# EAGLE design omcPendelautomatik (EAGLE 7.7.0)
Assembly variants: VO_3V2_FIX
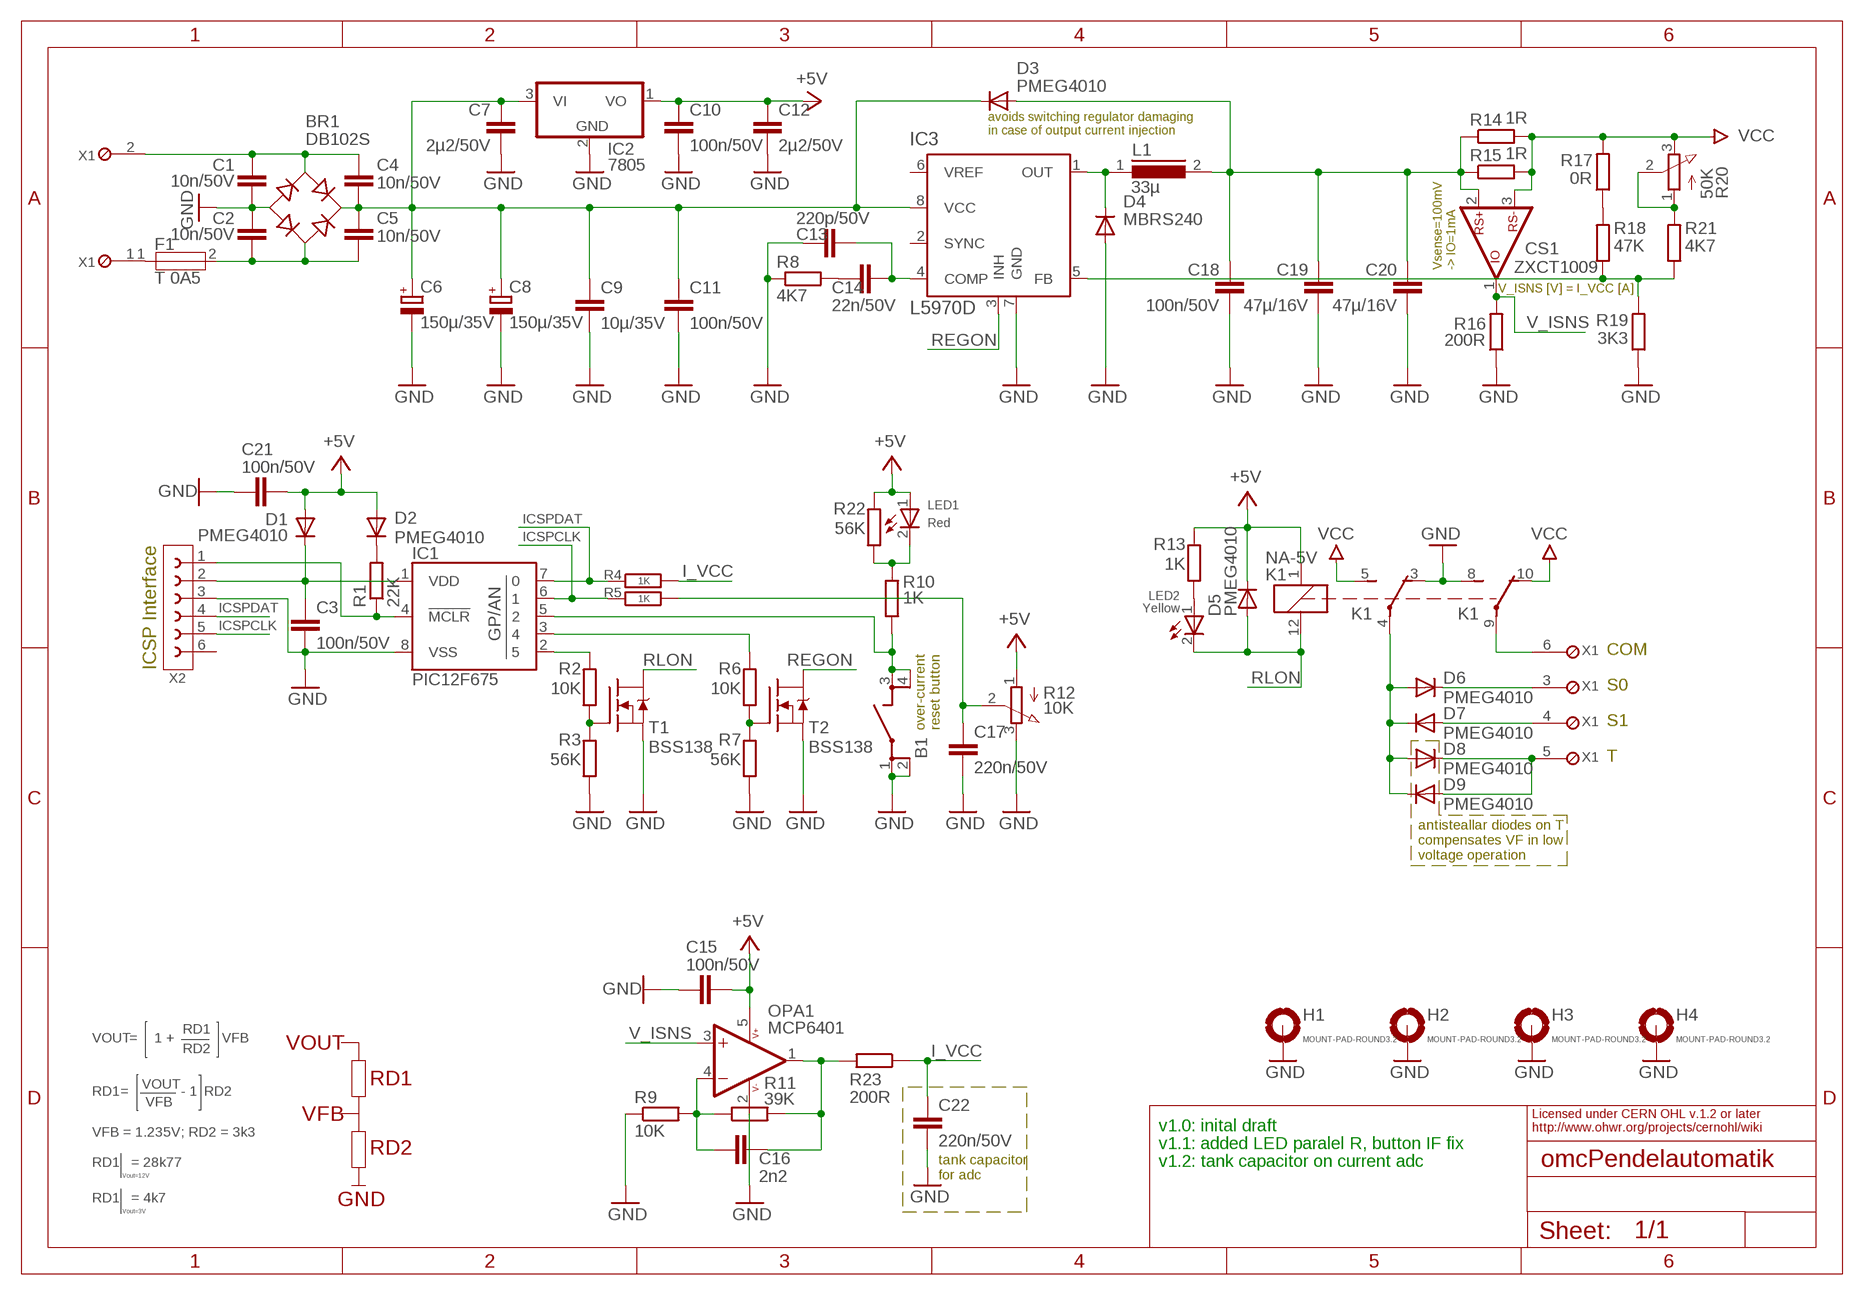
[diagram p0: schematic, sheet 1]

## Parts
B1  JTP1138/4.3  JTP1138-4.3MM  [SMD_X4_11X6]
BR1  DB102S  RECT-DIL-1A-100V-SMD  [DBS]
C1  10n/50V  X7R-10000P-1206  [1206]
C2  10n/50V  X7R-10000P-1206  [1206]
C3  100n/50V  X7R-100000P-1206  [1206]
C4  10n/50V  X7R-10000P-1206  [1206]
C5  10n/50V  X7R-10000P-1206  [1206]
C6  150µ/35V  AEC-150U-35V-F  [PANF]
C7  2µ2/50V  X7R-2200000P-1206  [1206]
C8  150µ/35V  AEC-150U-35V-F  [PANF]
C9  10µ/35V  X7R-10000000P-1210  [1210]
C10  100n/50V  X7R-100000P-1206  [1206]
C11  100n/50V  X7R-100000P-1206  [1206]
C12  2µ2/50V  X7R-2200000P-1206  [1206]
C13  220p/50V  NP0-220P-1206  [1206]
C14  22n/50V  X7R-22000P-1206  [1206]
C15  100n/50V  X7R-100000P-1206  [1206]
C16  2n2  NP0-2200P-1206  [1206]
C17  220n/50V  X7R-220000P-1206  [1206]
C18  100n/50V  X7R-100000P-1206  [1206]
C19  47µ/16V  X5R-47000000P-1210  [1210]
C20  47µ/16V  X5R-47000000P-1210  [1210]
C21  100n/50V  X7R-100000P-1206  [1206]
C22  220n/50V  X7R-220000P-1206  [1206]
CS1  ZXCT1009  ZXCT1009F  [SOT23]
D1  PMEG4010  PMEGXX10-40VBEA  [SOD323]
D2  PMEG4010  PMEGXX10-40VBEA  [SOD323]
D3  PMEG4010  PMEGXX10-40VBEA  [SOD323]
D4  MBRS240  [DO214AA]
D5  PMEG4010  PMEGXX10-40VBEA  [SOD323]
D6  PMEG4010  PMEGXX10-40VBEA  [SOD323]
D7  PMEG4010  PMEGXX10-40VBEA  [SOD323]
D8  PMEG4010  PMEGXX10-40VBEA  [SOD323]
D9  PMEG4010  PMEGXX10-40VBEA  [SOD323]
F1  T 0A5  OMT-T0A5-125V  [OMT125]
H1  MOUNT-PAD-ROUND3.2  [3,2-PAD]
H2  MOUNT-PAD-ROUND3.2  [3,2-PAD]
H3  MOUNT-PAD-ROUND3.2  [3,2-PAD]
H4  MOUNT-PAD-ROUND3.2  [3,2-PAD]
IC1  PIC12F675  PIC12F675SN  [SOIC08]
IC2  7805  78L05ACY  [SOT89W]
IC3  L5970D  [SOIC08]
K1  NA-5V  NA-5VDC  [THT_5M08M_5M08M_2M54M]
L1  33µ  PISM-330X  [PISM]
LED1  Red  LEDMONO-RED-KP3216  [LED3216]
LED2  Yellow  LEDMONO-YELLOW-KP3216  [LED3216]
OPA1  MCP6401  [SOT23-5]
R1  22K  RC1206-22000  [1206]
R2  10K  RC1206-10000  [1206]
R3  56K  RC1206-56000  [1206]
R4  1K  RC1206-1000  [1206]
R5  1K  RC1206-1000  [1206]
R6  10K  RC1206-10000  [1206]
R7  56K  RC1206-56000  [1206]
R8  4K7  RC1206-4700  [1206]
R9  10K  RC1206-10000  [1206]
R10  1K  RC1206-1000  [1206]
R11  39K  RC1206-39000  [1206]
R12  10K  M44-10000W  [TTM44W]
R13  1K  RC1206-1000  [1206]
R14  1R  RC1206-1.0  [1206]
R15  1R  RC1206-1.0  [1206]
R16  200R  RC1206-200  [1206]
R17  0R  RC1206-0.0  [1206]
R18  47K  RC1206-47000  [1206]
R19  3K3  RC1206-3300  [1206]
R20  50K  M44-50000W  [TTM44W]  (not fitted in variant VO_3V2_FIX)
R21  4K7  RC1206-4700  [1206]  (not fitted in variant VO_3V2_FIX)
R22  56K  RC1206-56000  [1206]
R23  200R  RC1206-200  [1206]
T1  BSS138  [SOT23]
T2  BSS138  [SOT23]
X1  RT034 Typ 086  SCWTRMX06-3M81  [RT03406T086]
X2  2X3  BOXHD-06-S-2.54  [BOXHD-06-2.54-S]

## Nets
+5V: C10.1 C12.1 C15.2 C21.2 D1.A D2.A D5.C IC2.1(VO) K1.1 LED1.1(A) OPA1.5(V+) R12.1(A) R13.2 R22.2
GND: B1.1 B1.2 BR1.- C1.2 C2.1 C3.2 C6.CN(-) C7.2 C8.CN(-) C9.2 C10.2 C11.2 C12.2 C13.1 C15.1 C17.2 C18.2 C19.2 C20.2 C21.1 C22.2 D4.A H1.B3,2(MOUNT) H2.B3,2(MOUNT) H3.B3,2(MOUNT) H4.B3,2(MOUNT) IC1.8(VSS) IC2.2(GND) IC3.7(GND) K1.3(O) K1.8(S) OPA1.2(V-) R3.1 R7.1 R8.1 R9.1 R12.3(E) R16.1 R19.1 T1.2(S) T2.2(S) X2.3
I_VCC: C22.1 R4.2 R23.1
ICSPCLK: IC1.6 R5.1 X2.5
ICSPDAT: IC1.7 R4.1 X2.4
N$1: D4.C IC3.1(OUT) L1.1
N$2: R20.1(A) R20.2(S) R21.2
N$3: C13.2 C14.1 IC3.4(COMP)
N$4: C14.2 R8.2
N$5: R2.1 R3.2 T1.1(G)
N$6: BR1.+ C4.2 C5.1 C6.CP(+) C7.1 C8.CP(+) C9.1 C11.1 D3.C IC2.3(VI) IC3.8(VCC)
N$7: C3.1 D1.C IC1.1(VDD) X2.2
N$8: F1.1 X1.1
N$9: IC3.5(FB) R18.1 R19.2 R21.1
N$10: IC1.4(!MCLR!) R1.1 X2.1
N$11: D2.C R1.2
N$12: IC1.2 R2.2
N$13: R6.1 R7.2 T2.1(G)
N$14: IC1.3 R6.2
N$15: LED2.1(A) R13.1
N$16: R17.1 R18.2
N$17: BR1.AC1 C1.1 C4.1 X1.2
N$18: D6.C X1.3
N$19: C17.1 R5.2 R12.2(S)
N$20: C16.1 OPA1.4(-IN) R9.2 R11.1
N$21: D7.A X1.4
N$22: D6.A D7.C D8.A D9.C K1.4(P)
N$23: BR1.AC2 C2.2 C5.2 F1.2
N$24: K1.9(P) X1.6
N$27: B1.3 B1.4 IC1.5 R10.1
N$29: D8.C D9.A X1.5
N$32: LED1.2(C) R10.2 R22.1
N$33: C16.2 OPA1.1(OUT) R11.2 R23.2
REGON: IC3.3(INH) T2.3(D)
RLON: D5.A K1.12 LED2.2(C) T1.3(D)
V_ISNS: CS1.1(IOUT) OPA1.3(+IN) R16.2
VCC: CS1.3(-RS) K1.5(S) K1.10(O) R14.2 R15.2 R17.2 R20.3(E)
VOUT: C18.1 C19.1 C20.1 CS1.2(+RS) D3.A L1.2 R14.1 R15.1
Unconnected: IC3.2(SYNC) IC3.6(VREF) X2.6

## Notes on the sheet
- avoids switching regulator damaging
  in case of output current injection
- Vsense=100mV
  -> IO=1mA
- V_ISNS [V] = I_VCC [A]
- COM
- ICSP Interface
- S0
- S1
- over-current
  reset button
- T
- antisteallar diodes on T
  compensates VF in low
  voltage operation
- RD1
- VOUT | = | 1 + | VFB
- RD2 | VOUT
- VOUT | RD1
- RD1 | = | - 1 | RD2
- VFB
- VFB
- v1.0: inital draft
- Licensed under CERN OHL v.1.2 or later
  http://www.ohwr.org/projects/cernohl/wiki
- VFB = 1.235V; RD2 = 3k3
- v1.1: added LED paralel R, button IF fix
- RD2
- RD1 | = 28k77 | v1.2: tank capacitor on current adc
- Vout=12V
- tank capacitor
  for adc
- RD1 | = 4k7 | GND
- Vout=3V

## Power pins joined to a net without a drawn wire
GND: IC2.4(GND)

## Library data of the parts
B1 = omcSwitch:JTP1138: TACT SWITCH - JTP 1138 6mm x 6mm 12 V DC / 0,05 A Bounce Time 10ms Datasheet: Reichelt <https://cdn-reichelt.de/documents/datenblatt/C200/JTP_1138_DB01.PDF>; DIST#REICHELT#: TASTER 9314
BR1 = omcDiode:RECT-DIL-1A: DIL Rechtifier - 1.0A Single-Phase Glass Passivated Bridge Rectifier Diodes Incorporate: Diodes Incorporate Datasheet <http://www.diodes.com/_files/datasheets/ds21201.pdf> (DB10XS) Reichelt Datasheet <http://cdn-reichelt.de/documents/datenblatt/A400/SMD_DF_02_SEP_DB.PDF> (DB10XS) SEP Electronic Corp: Reichelt Datasheet <http://cdn-reichelt.de/documents/datenblatt/A400/DB101S-DB107S_SEP.PDF> (DB10XS) Reichelt Datasheet <http://cdn-reichelt.de/documents/datenblatt/A400/DB101-DB107_SEP.PDF> (DB10X) Diodes Incorporate - Maximum Ratings and Electrical Characteristics Characteristics DB101/S DB102/S DB103/S DB104/S DB105/S DB106/S DB107/S Unit Maximum Recurrent Peak Reverse Voltage 50 100 200 400 600 800 1000 V Maximum RMS Input Voltage 35 70 140 280 420 560 700 V Maximum DC Blocking Voltage 50 100 200 400 600 800 1000 V Maximum Average Rectified Output Current @TA=40°C 1.0 A Peak Forward Surge Current Single Half Sine-wave Superimposed on Rated Load 50 A Maximum Instantaneous Forward Voltage drop per Element at IF=1.0A 1.1 V Maximum Reverse DC Current at Rated @TA=25°C DC Blocking Voltage per Element @TA=100°C 10 500 µA µA Typical Thermal Resistance 40 K/W Storage and Operating Temperature Range -65 to +150 °C; DIST#REICHELT#: SMD DB1A70; VENDOR#: SEP ELECTRONIC CORP.,DB102S
C1 C2 C4 C5 = omcCapacitor:X7R: X7R Ceramic Capacitors YAGEO Multilayer Capacitors For General Purpose Temperature characteristics: X7R Rated Voltage: 50V Operating Temperature Range: –55°C to +125°C Reichelt Datasheet <http://cdn-reichelt.de/documents/datenblatt/B300/X7R.pdf> MURATA GCM Series High Dielectric Constant Type Murata Datasheet <http://www.murata.com/~/media/webrenewal/support/library/catalog/products/capacitor/mlcc/c03e.ashx> Reichelt Datasheet <http://cdn-reichelt.de/documents/datenblatt/A900/DATASHEET_SMD_0805_1206_1210.pdf>; DIST#REICHELT#: X7R-G1206 10N; VENDOR#: YAGEO,12062R103K9BP0D
C3 C10 C11 C15 C18 C21 = omcCapacitor:X7R: X7R Ceramic Capacitors YAGEO Multilayer Capacitors For General Purpose Temperature characteristics: X7R Rated Voltage: 50V Operating Temperature Range: –55°C to +125°C Reichelt Datasheet <http://cdn-reichelt.de/documents/datenblatt/B300/X7R.pdf> MURATA GCM Series High Dielectric Constant Type Murata Datasheet <http://www.murata.com/~/media/webrenewal/support/library/catalog/products/capacitor/mlcc/c03e.ashx> Reichelt Datasheet <http://cdn-reichelt.de/documents/datenblatt/A900/DATASHEET_SMD_0805_1206_1210.pdf>; DIST#REICHELT#: X7R-G1206 100N; VENDOR#: YAGEO,12062R104K9BP0D
C6 C8 = omcCapacitor:AEC: Aluminum Electrolytic Capacitors Panasonic - FC/FK Series: Life time: 105°C 1000 h Operating temperature range: -40 to + 105°C Voltage rating: 6.3 to 50 VDC Capacitance range: 1µF to 1500µF Panasonic Productside <http://industrial.panasonic.com/ww/products/capacitors/aluminum-capacitors/aluminum-cap-smd> Panasonic Datasheet <http://industrial.panasonic.com/cdbs/www-data/pdf/RDE0000/DME0000COL51.pdf> Reichelt Datasheet <http://cdn-reichelt.de/documents/datenblatt/B300/Al-SMD_FCneu.pdf> Distributor Reichelt: avialable Conrad: avialable Digi-Key: -; DIST#REICHELT#: VF 150/35 P-F; ESR: 0R08; I_RIPPLE: 850m; VENDOR#: PANASONIC#EEEFP1V151AP
C7 C12 = omcCapacitor:X7R: X7R Ceramic Capacitors YAGEO Multilayer Capacitors For General Purpose Temperature characteristics: X7R Rated Voltage: 50V Operating Temperature Range: –55°C to +125°C Reichelt Datasheet <http://cdn-reichelt.de/documents/datenblatt/B300/X7R.pdf> MURATA GCM Series High Dielectric Constant Type Murata Datasheet <http://www.murata.com/~/media/webrenewal/support/library/catalog/products/capacitor/mlcc/c03e.ashx> Reichelt Datasheet <http://cdn-reichelt.de/documents/datenblatt/A900/DATASHEET_SMD_0805_1206_1210.pdf>; DIST#REICHELT#: X7R-G1206 2,2/50; VENDOR#: MURATA,GCM31CR71H225KA55
C9 = omcCapacitor:X7R: X7R Ceramic Capacitors YAGEO Multilayer Capacitors For General Purpose Temperature characteristics: X7R Rated Voltage: 50V Operating Temperature Range: –55°C to +125°C Reichelt Datasheet <http://cdn-reichelt.de/documents/datenblatt/B300/X7R.pdf> MURATA GCM Series High Dielectric Constant Type Murata Datasheet <http://www.murata.com/~/media/webrenewal/support/library/catalog/products/capacitor/mlcc/c03e.ashx> Reichelt Datasheet <http://cdn-reichelt.de/documents/datenblatt/A900/DATASHEET_SMD_0805_1206_1210.pdf>; DIST#REICHELT#: X7R-G1210 10; VENDOR#: MURATA,GCM32EC7YA106KA03
C13 = omcCapacitor:NP0: NP0 Surface-Mount Ceramic Multilayer Capacitors YAGEO Multilayer Capacitors For General Purpose RoHS compliant Rated Voltage: 50V Operating Temperature Range: –55°C to +125°C Yageo Datasheet <http://www.yageo.com/documents/recent/UPY-GP_NP0_16V-to-50V_8.pdf> Distributor Reichelt: avialable Conrad: avialable Digi-Key: -; DIST#REICHELT#: NPO-G1206 220P; VENDOR#: YAGEO#1206CG221J9BP
C14 = omcCapacitor:X7R: X7R Ceramic Capacitors YAGEO Multilayer Capacitors For General Purpose Temperature characteristics: X7R Rated Voltage: 50V Operating Temperature Range: –55°C to +125°C Reichelt Datasheet <http://cdn-reichelt.de/documents/datenblatt/B300/X7R.pdf> MURATA GCM Series High Dielectric Constant Type Murata Datasheet <http://www.murata.com/~/media/webrenewal/support/library/catalog/products/capacitor/mlcc/c03e.ashx> Reichelt Datasheet <http://cdn-reichelt.de/documents/datenblatt/A900/DATASHEET_SMD_0805_1206_1210.pdf>; DIST#REICHELT#: X7R-G1206 22N; VENDOR#: YAGEO,12062R223K9BP0D
C16 = omcCapacitor:NP0: NP0 Surface-Mount Ceramic Multilayer Capacitors YAGEO Multilayer Capacitors For General Purpose RoHS compliant Rated Voltage: 50V Operating Temperature Range: –55°C to +125°C Yageo Datasheet <http://www.yageo.com/documents/recent/UPY-GP_NP0_16V-to-50V_8.pdf> Distributor Reichelt: avialable Conrad: avialable Digi-Key: -; DIST#REICHELT#: NPO-G1206 2,2N; VALUE: 2n2/50V; VENDOR#: YAGEO#1206CG222J9BP
C17 C22 = omcCapacitor:X7R: X7R Ceramic Capacitors YAGEO Multilayer Capacitors For General Purpose Temperature characteristics: X7R Rated Voltage: 50V Operating Temperature Range: –55°C to +125°C Reichelt Datasheet <http://cdn-reichelt.de/documents/datenblatt/B300/X7R.pdf> MURATA GCM Series High Dielectric Constant Type Murata Datasheet <http://www.murata.com/~/media/webrenewal/support/library/catalog/products/capacitor/mlcc/c03e.ashx> Reichelt Datasheet <http://cdn-reichelt.de/documents/datenblatt/A900/DATASHEET_SMD_0805_1206_1210.pdf>; DIST#REICHELT#: KEM X7R1206 220N; VENDOR#: KEMET,1206C225K5R
C19 C20 = omcCapacitor:X5R: X5R Ceramic Capacitors Murate GRM Series For General Purpose Temperature characteristics: X5R Size: 0.4×0.2mm to 5.7×5.0mm Rated Voltage: DC2.5V to 3.15kV Operating Temperature Range: –55°C to +85°C Product Side <http://psearch.en.murata.com/capacitor/lineup/grm> Murata Datasheet <http://www.murata.com/~/media/webrenewal/support/library/catalog/products/capacitor/mlcc/c02e.ashx> Distributor Reichelt: avialable Conrad: avialable Digi-Key: -; DIST#REICHELT#: X5R-G1210 47; VENDOR#: MURATA,GRM32ER61C476ME15#
CS1 = omcPwrSupply:ZXCT1009: ZXCT1009 - HIGH-SIDE CURRENT MONITOR Low cost, accurate high-side current sensing Output voltage scaling Up to 2.5V sense voltage 2.5V to 20V supply range 4μA quiescent current 1% typical accuracy SOT23 and SM8 packages Datasheet Diodes Incorporated <https://www.diodes.com/assets/Datasheets/ZXCT1009.pdf> Reichelt <https://cdn-reichelt.de/documents/datenblatt/A200/DID_ZXCT1009_ENG_TDS.pdf>; DIST#REICHELT#: ZXCT 1009FTA; VENDOR#: Diodes Incorporated, ZXCT1009
D1-D3 D5-D9 = omcDiode:PMEGXX10: PMEGXX10 - 1A very low VF MEGA Schottky barrier rectifier - NXP Schottky Forward current: 1 A Reverse voltages: 20V, 30V, 40V Very low forward voltage Datasheet: Nexperia <https://assets.nexperia.com/documents/data-sheet/PMEGXX10BEA_PMEGXX10BEV.pdf> Reichelt <https://cdn-reichelt.de/documents/datenblatt/A400/PMEG4010BEA_ENG_TDS.pdf>; DIST#REICHELT#: PMEG 4010BEA NXP; VENDOR#: NXP,PMEG3010BEA
D4 = omcDiode:MBRS2: MBRS2X0 - 2A Schottky Power Rectifier Schottky barrier rectifiers 2A 40V SMB 403A-03 (DO213AB) Package Fairchild MBRS320 Datasheet <https://www.fairchildsemi.com/datasheets/MB/MBRS320.pdf> Reichelt Datasheet <http://cdn-reichelt.de/documents/datenblatt/A400/MBRS240SMD_ONS.pdf> Characteristics MBRS240 Unit Peak Repetitive Reverse Voltage 40 V Average Rectified Forward Current 2.0 @100°C A Nonrepetitive Peak Surge Current 25 A Operating Junction Temperature – 55 to +150 °C Thermal Resistance — Junction to Lead 18 °C/W Maximum Instantaneous Forward Voltage (IF = 3.0 A, TJ = 25°C)) 0.43 V Maximum Instantaneous Reverse Current Rated dc Voltage, TJ = 25°C Rated dc Voltage, TJ = 100°C 2.0 60 mA; DIST#REICHELT#: MBRS 240 SMD; VENDOR#: On Semiconductor,MBRS240LT3G
F1 = omcFuse:OMT: OMT - Non resettable SMD Fuse Describtion Directly solderable on printed circuit boards Standards UL 248-14 CSA C22.2 no. 248.14 Approvals UL File Number: E41599 Technical Data Type OMT125 OMT250 Rated Voltage 125 VAC/DC 125 - 250VAC, 125 VDC Rated Current 0.25 - 5 A 0.75 - 5A Breaking Capacity 100 A 50A - 100A Characteristic Time-Lag T Time-Lag T Mounting PCB,SMT Admissible Ambient Air Temp. -40 °C to 85 °C Climatic Category 40/085/21 acc. to IEC 60068-1 Material: Housing Thermoplastic, UL 94V-0 Material: Terminals Tin-Plated Copper Alloy Datasheet Schurter <http://www.schurter.ch/bundles/snceschurter/epim/_ProdPool_/newDS/de/typ_OMT_125.pdf> Reichelt <http://cdn-reichelt.de/documents/datenblatt/C400/typ_OMT_125.pdf> Schurter <http://www.schurter.ch/bundles/snceschurter/epim/_ProdPool_/newDS/de/typ_OMT.pdf> Reichelt <http://cdn-reichelt.de/documents/datenblatt/C400/OMT.pdf> Distributor Reichelt: avialable Conrad: Digi-Key:; DIST#REICHELT#: OMT 125 0,5A; VENDOR#: Schurter,3404.0112.11
H1-H4 = holes:MOUNT-PAD-ROUND: MOUNTING PAD, round
IC1 = omcPIC:PIC12F675: PIC12F675 - 8-Pin FLASH-Based 8-Bit CMOS Microcontrollers High Performance RISC CPU: Only 35 instructions All single cycle instructions except branches Operating speed: DC - 20 MHz oscillator/clock input DC - 200 ns instruction cycle Interrupt capability 8-level deep hardware stack Direct, Indirect, and Relative Addressing modes Special Microcontroller Features: Internal and external oscillator options Precision Internal 4 MHz oscillator factory calibrated to ±1% External Oscillator support for crystals and resonators 5 µs wake-up from SLEEP, 3.0V, typical Power saving SLEEP mode Wide operating voltage range - 2.0V to 5.5V Industrial and Extended temperature range Low power Power-on Reset (POR) Power-up Timer (PWRT) and Oscillator Start-up Timer (OST) Brown-out Detect (BOD) Watchdog Timer (WDT) with independent oscillator for reliable operation Multiplexed MCLR/Input-pin Interrupt-on-pin change Individual programmable weak pull-ups Programmable code protection High Endurance FLASH/EEPROM Cell 100,000 write FLASH endurance 1,000,000 write EEPROM endurance FLASH/Data EEPROM Retention: > 40 years Low Power Features: Standby Current: 1 nA @ 2.0V, typical Operating Current: 8.5 µA @ 32 kHz, 2.0V, typical 100 µA @ 1 MHz, 2.0V, typical Watchdog Timer Current: 300 nA @ 2.0V, typical Timer1 oscillator current: 4 µA @ 32 kHz, 2.0V, typical Peripheral Features: 6 I/O pins with individual direction control High current sink/source for direct LED drive Analog comparator module with: One analog comparator Programmable on-chip comparator voltage reference (CVREF) module Programmable input multiplexing from device inputs Comparator output is externally accessible Analog-to-Digital Converter module: 10-bit resolution Programmable 4-channel input Voltage reference input Timer0: 8-bit timer/counter with 8-bit programmable prescaler Enhanced Timer1: 16-bit timer/counter with prescaler External Gate Input mode Option to use OSC1 and OSC2 in LP mode as Timer1 oscillator, if INTOSC mode selected In-Circuit Serial Programming (ICSP) via two pins Reference: Microchip Datasheet <http://ww1.microchip.com/downloads/en/DeviceDoc/41190G.pdf> Reichelt Datasheet <http://cdn-reichelt.de/documents/datenblatt/A300/PIC12F629_PIC12F675%23MIC.pdf>; DIST#REICHELT#: PIC 12F675-I/SN; VENDOR#: Microchip#PIC12F675-I/SN
IC2 = omcPwrSupply:78L: STMicroelectronics - L78L - Positive voltage regulators Output current up to 100 mA Output voltages of 3.3; 5; 6; 8; 9; 10; 12; 15; 18; 24 V Thermal overload protection Short-circuit protection No external components are required STM Datasheet <www.st.com/resource/en/datasheet/l78l.pdf> Reichelt Datasheet <http://cdn-reichelt.de/documents/datenblatt/A200/DS_TS78_SERIES.pdf> (Taiwan Semiconductor); DIST#REICHELT#: TS 78L05 ACY; VENDOR#: STM,L78L05ABUTR
IC3 = omcPwrSupply:L5970D: STMicroelectronics - L5970D - Up to 1A step down switching regulator Up to 1A output current Operating input voltage from 4.4V to 36V 3.3V / (±2%) reference voltage Output voltage adjustable from 1.2V to 35V Low dropout operation: 100% duty cycle 250KHz Internally fixed frequency Voltage feedforward Zero load current operation Internal current limiting Inhibit for zero current consumption Synchronization Protection against feedback disconnection Thermal shutdown STM Datasheet <http://www.st.com/web/en/resource/technical/document/datasheet/CD00002173.pdf> Reichelt Datasheet <http://cdn-reichelt.de/documents/datenblatt/A200/DS_5970D.pdf>; DIST#CONRAD#: 1185187 - 62; DIST#REICHELT#: L 5970 D; VENDOR#: STM,L5970D013TR
K1 = omcRelay:NA: Fujitsu NA - Minature Relay - 2 Poles - 1 to 2A 2-pole max. Voltage: 125VAC / 30VDC max. Power: 62VA / 30W min load: 0.01mA, 10mVDC slim type relay for high density mounting UL, CSA recognized Datasheet Fujitsu <https://www.fujitsu.com/downloads/MICRO/fcai/relays/na.pdf> Reichelt <https://cdn-reichelt.de/documents/datenblatt/C300/RELAIS-NA.pdf>; DIST#REICHELT#: NA 05W K; VENDOR#: Fujitsu,NAA-05W-K
L1 = omcInductor:PISM: PISM - SMD Power Inductors Inductance: 1µH - 2200µH Current: 0.25A - 10A Mounting: SMD Material: Ferrite Dimension: L: 13mm W: 9.55mm H: 5.35mm Fastron Datasheet <http://www.fastrongroup.com/image-show/56/PISM.pdf?type=Complete-DataSheet&productType=series> Reichelt Datasheet <http://cdn-reichelt.de/documents/datenblatt/B400/PISM.pdf> Inductance L [µH] fL [MHz] SRFmin [MHz] DCRmax [Ω] Rated DC Current [A] Isat IΔT 1.0 0.1 115 0.008 10 6.9 1.5 0.1 90 0.009 9 6.5 2.2 0.1 80 0.010 8 6.2 3.3 0.1 58 0.014 7 5.5 4.7 0.1 49 0.017 6 4.9 6.8 0.1 39 0.022 5.1 4.4 10 0.1 28 0.036 4.2 3.9 15 0.1 22 0.050 3.2 3.2 22 0.1 17 0.060 2.7 2.7 33 0.1 13 0.100 2.1 2.1 47 0.1 10 0.140 1.7 1.7 68 0.1 8.5 0.190 1.5 1.5 100 0.1 7.0 0.280 1.2 1.2 150 0.1 5.3 0.420 1.0 1.0 220 0.1 4.1 0.600 0.85 0.85 330 0.1 3.2 0.900 0.65 0.65 470 0.1 2.8 1.250 0.55 0.55 680 0.1 2.3 2.00 0.45 0.45 1000 0.1 1.7 2.70 0.35 0.35 2200 0.1 1.4 7.00 0.25 0.22 Distributor Reichelt: L-PISM XXµ Conrad: avialable Digi-Key: -; DIST#REICHELT#: L-PISM 33µ; VENDOR#: Fastron,PISM-330X-04
LED1 = omcOpto:LEDMONO: LED Monochromatic Knighbright (KP3216) 3.2x1.6mm (1206) SMD chip LED lamps operating temperature: -40 to +85 °C Reichelt Datasheet (Red/Green/Yellow) <http://cdn-reichelt.de/documents/datenblatt/A500/KP-3216SERIES.pdf> Reichelt Datasheet (Blue) <http://cdn-reichelt.de/documents/datenblatt/A500/KP-3216QBC-D.pdf> Knighbright (KP2012) 2.0x1.25mm (0805) SMD chip LED lamps Conrad Datasheet <http://www.produktinfo.conrad.com/datenblaetter/1000000-1099999/001050393-da-01-en-SMD_CHIPLED_OR_0805_KP_2012SECK.pdf> Knighbright (KP1608) SMD 0603 1.6mm x 0.8mm SMD LED Datasheet Color: Blue [Conrad] <http://www.produktinfo.conrad.com/datenblaetter/1000000-1099999/001050379-da-01-en-SMD_CHIPLED_BL_0603_KP_1608QBC_D.pdf> Green [Conrad] <http://www.produktinfo.conrad.com/datenblaetter/1000000-1099999/001050377-da-01-en-SMD_CHIPLED_GR_0603_KP_1608CGCK.pdf> Orange [Conrad] <http://www.produktinfo.conrad.com/datenblaetter/1000000-1099999/001050375-da-01-en-SMD_CHIPLED_OR_0603_KP_1608SECK.pdf> Red [Conrad] <http://www.produktinfo.conrad.com/datenblaetter/1000000-1099999/001050374-da-01-en-SMD_CHIPLED_ROT_0603_KP_1608SURCK.pdf> Yellow [Conrad] <http://www.produktinfo.conrad.com/datenblaetter/1000000-1099999/001050376-da-01-en-SMD_CHIPLED_GE_0603_KP_1608SYCK.pdf> Everlight (2521) 3.2x1.6mm (1206) SMD chip LED lamps Reichelt Datasheet (Orange) <http://cdn-reichelt.de/documents/datenblatt/A500/15-21-S2C-AQ2R2B.pdf> Reichelt Datasheet (White) <http://cdn-reichelt.de/documents/datenblatt/A500/15-21-T7D-JQ2S1PY.pdf> Lucky Light (S172) 2.0x1.25mm (0805) SMD chip LED lamps Reichelt Datasheet (White) <http://cdn-reichelt.de/documents/datenblatt/A500/S172W-W2-1C.pdf>; DIST#REICHELT#: SMD-LED 1206 RT; VENDOR#: Kingbright,KP-3216HD
LED2 = omcOpto:LEDMONO: LED Monochromatic Knighbright (KP3216) 3.2x1.6mm (1206) SMD chip LED lamps operating temperature: -40 to +85 °C Reichelt Datasheet (Red/Green/Yellow) <http://cdn-reichelt.de/documents/datenblatt/A500/KP-3216SERIES.pdf> Reichelt Datasheet (Blue) <http://cdn-reichelt.de/documents/datenblatt/A500/KP-3216QBC-D.pdf> Knighbright (KP2012) 2.0x1.25mm (0805) SMD chip LED lamps Conrad Datasheet <http://www.produktinfo.conrad.com/datenblaetter/1000000-1099999/001050393-da-01-en-SMD_CHIPLED_OR_0805_KP_2012SECK.pdf> Knighbright (KP1608) SMD 0603 1.6mm x 0.8mm SMD LED Datasheet Color: Blue [Conrad] <http://www.produktinfo.conrad.com/datenblaetter/1000000-1099999/001050379-da-01-en-SMD_CHIPLED_BL_0603_KP_1608QBC_D.pdf> Green [Conrad] <http://www.produktinfo.conrad.com/datenblaetter/1000000-1099999/001050377-da-01-en-SMD_CHIPLED_GR_0603_KP_1608CGCK.pdf> Orange [Conrad] <http://www.produktinfo.conrad.com/datenblaetter/1000000-1099999/001050375-da-01-en-SMD_CHIPLED_OR_0603_KP_1608SECK.pdf> Red [Conrad] <http://www.produktinfo.conrad.com/datenblaetter/1000000-1099999/001050374-da-01-en-SMD_CHIPLED_ROT_0603_KP_1608SURCK.pdf> Yellow [Conrad] <http://www.produktinfo.conrad.com/datenblaetter/1000000-1099999/001050376-da-01-en-SMD_CHIPLED_GE_0603_KP_1608SYCK.pdf> Everlight (2521) 3.2x1.6mm (1206) SMD chip LED lamps Reichelt Datasheet (Orange) <http://cdn-reichelt.de/documents/datenblatt/A500/15-21-S2C-AQ2R2B.pdf> Reichelt Datasheet (White) <http://cdn-reichelt.de/documents/datenblatt/A500/15-21-T7D-JQ2S1PY.pdf> Lucky Light (S172) 2.0x1.25mm (0805) SMD chip LED lamps Reichelt Datasheet (White) <http://cdn-reichelt.de/documents/datenblatt/A500/S172W-W2-1C.pdf>; DIST#REICHELT#: SMD-LED 1206 GE; VENDOR#: Kingbright,KP-3216SYD
OPA1 = omcOpAmp:MCP6401: MCP6401 - 1 MHz, 45 μA Op Amps - Microchip Low Quiescent Current: 45 μA (typical) Gain Bandwidth Product: 1 MHz (typical) Rail-to-Rail Input and Output Supply Voltage Range: 1.8V to 6.0V Unity Gain Stable Extended Temperature Range: -40°C to +125°C No Phase Reversal Datasheet: Microchip <http://ww1.microchip.com/downloads/en/devicedoc/22229d.pdf> Reichelt <https://cdn-reichelt.de/documents/datenblatt/A200/MCP6401-2-4.pdf>; DIST#REICHELT#: MCP 6401T-E/OT; VENDOR#: Microchip, MCP6401T-E/OT
R1 = omcResistor:RC1206: YAGEO RC1206 - General Purpose Chip Resistors Power dissipation: 0.250W 1% Tolerance E96 Series Operating Temperature Range: –55°C to +155°C Maximum Working Voltage: 200V Maximum Overload Voltage: 400V Temperature Coefficient: 10Ω< R≤10MΩ: ±100 ppm/°C R≤10Ω || R>10 MΩ: ±200 ppm/°C Jumper Criteria Rated Current: 2A Maximum Current: 10A Yageo Datasheet <http://www.yageo.ru/pdf/RC1206.pdf> Reichelt Datasheet <http://cdn-reichelt.de/documents/datenblatt/A900/SMD_1206.pdf> Distributor Reichelt: E24 Conrad: avialable Digi-Key: -; DIST#REICHELT#: SMD 1/4W 22K; VENDOR#: YAGEO#RC1206FR-0722KL
R2 R6 R9 = omcResistor:RC1206: YAGEO RC1206 - General Purpose Chip Resistors Power dissipation: 0.250W 1% Tolerance E96 Series Operating Temperature Range: –55°C to +155°C Maximum Working Voltage: 200V Maximum Overload Voltage: 400V Temperature Coefficient: 10Ω< R≤10MΩ: ±100 ppm/°C R≤10Ω || R>10 MΩ: ±200 ppm/°C Jumper Criteria Rated Current: 2A Maximum Current: 10A Yageo Datasheet <http://www.yageo.ru/pdf/RC1206.pdf> Reichelt Datasheet <http://cdn-reichelt.de/documents/datenblatt/A900/SMD_1206.pdf> Distributor Reichelt: E24 Conrad: avialable Digi-Key: -; DIST#REICHELT#: SMD 1/4W 10K; VENDOR#: YAGEO#RC1206FR-0710KL
R3 R7 R22 = omcResistor:RC1206: YAGEO RC1206 - General Purpose Chip Resistors Power dissipation: 0.250W 1% Tolerance E96 Series Operating Temperature Range: –55°C to +155°C Maximum Working Voltage: 200V Maximum Overload Voltage: 400V Temperature Coefficient: 10Ω< R≤10MΩ: ±100 ppm/°C R≤10Ω || R>10 MΩ: ±200 ppm/°C Jumper Criteria Rated Current: 2A Maximum Current: 10A Yageo Datasheet <http://www.yageo.ru/pdf/RC1206.pdf> Reichelt Datasheet <http://cdn-reichelt.de/documents/datenblatt/A900/SMD_1206.pdf> Distributor Reichelt: E24 Conrad: avialable Digi-Key: -; DIST#REICHELT#: SMD 1/4W 56K; VENDOR#: YAGEO#RC1206FR-0756KL
R4 R5 R10 R13 = omcResistor:RC1206: YAGEO RC1206 - General Purpose Chip Resistors Power dissipation: 0.250W 1% Tolerance E96 Series Operating Temperature Range: –55°C to +155°C Maximum Working Voltage: 200V Maximum Overload Voltage: 400V Temperature Coefficient: 10Ω< R≤10MΩ: ±100 ppm/°C R≤10Ω || R>10 MΩ: ±200 ppm/°C Jumper Criteria Rated Current: 2A Maximum Current: 10A Yageo Datasheet <http://www.yageo.ru/pdf/RC1206.pdf> Reichelt Datasheet <http://cdn-reichelt.de/documents/datenblatt/A900/SMD_1206.pdf> Distributor Reichelt: E24 Conrad: avialable Digi-Key: -; DIST#REICHELT#: SMD 1/4W 1,0K; VENDOR#: YAGEO#RC1206FR-071K0L
R8 R21 = omcResistor:RC1206: YAGEO RC1206 - General Purpose Chip Resistors Power dissipation: 0.250W 1% Tolerance E96 Series Operating Temperature Range: –55°C to +155°C Maximum Working Voltage: 200V Maximum Overload Voltage: 400V Temperature Coefficient: 10Ω< R≤10MΩ: ±100 ppm/°C R≤10Ω || R>10 MΩ: ±200 ppm/°C Jumper Criteria Rated Current: 2A Maximum Current: 10A Yageo Datasheet <http://www.yageo.ru/pdf/RC1206.pdf> Reichelt Datasheet <http://cdn-reichelt.de/documents/datenblatt/A900/SMD_1206.pdf> Distributor Reichelt: E24 Conrad: avialable Digi-Key: -; DIST#REICHELT#: SMD 1/4W 4,7K; VENDOR#: YAGEO#RC1206FR-074K7L
R11 = omcResistor:RC1206: YAGEO RC1206 - General Purpose Chip Resistors Power dissipation: 0.250W 1% Tolerance E96 Series Operating Temperature Range: –55°C to +155°C Maximum Working Voltage: 200V Maximum Overload Voltage: 400V Temperature Coefficient: 10Ω< R≤10MΩ: ±100 ppm/°C R≤10Ω || R>10 MΩ: ±200 ppm/°C Jumper Criteria Rated Current: 2A Maximum Current: 10A Yageo Datasheet <http://www.yageo.ru/pdf/RC1206.pdf> Reichelt Datasheet <http://cdn-reichelt.de/documents/datenblatt/A900/SMD_1206.pdf> Distributor Reichelt: E24 Conrad: avialable Digi-Key: -; DIST#REICHELT#: SMD 1/4W 39K; VENDOR#: YAGEO#RC1206FR-0739KL
R12 = omcResistor:M44: Model 44 - Cermet Trimming Potentiometer - TT Electronics Electrical: Standard Resistance Range: 10 Ohms to 2 Megohms Standard Resistance Tolerance: ±10% (<100 Ohms = ±20%) Input Voltage: 300 Vdc Max. or rms not to exceed power rating Power Rating: 0.25 Watts at 85°C derating to 0 at 150°C Environmental: Operating Temperature: –65°C to +150°C Load Life: 1,000 hours at 85°C & 0.25 Watts Datasheet: TT Electronics <https://www.ttelectronics.com/TTElectronics/media/ProductFiles/Trimmers/Datasheets/44.pdf> Reichelt <https://cdn-reichelt.de/documents/datenblatt/B400/BI-SERIE-44.pdf>; DIST#REICHELT#: 44W-10K; VENDOR#: TT Electronics, 44 G R 10K LF
R14 R15 = omcResistor:RC1206: YAGEO RC1206 - General Purpose Chip Resistors Power dissipation: 0.250W 1% Tolerance E96 Series Operating Temperature Range: –55°C to +155°C Maximum Working Voltage: 200V Maximum Overload Voltage: 400V Temperature Coefficient: 10Ω< R≤10MΩ: ±100 ppm/°C R≤10Ω || R>10 MΩ: ±200 ppm/°C Jumper Criteria Rated Current: 2A Maximum Current: 10A Yageo Datasheet <http://www.yageo.ru/pdf/RC1206.pdf> Reichelt Datasheet <http://cdn-reichelt.de/documents/datenblatt/A900/SMD_1206.pdf> Distributor Reichelt: E24 Conrad: avialable Digi-Key: -; DIST#REICHELT#: SMD 1/4W 1,0; VENDOR#: YAGEO#RC1206FR-071R0L
R16 R23 = omcResistor:RC1206: YAGEO RC1206 - General Purpose Chip Resistors Power dissipation: 0.250W 1% Tolerance E96 Series Operating Temperature Range: –55°C to +155°C Maximum Working Voltage: 200V Maximum Overload Voltage: 400V Temperature Coefficient: 10Ω< R≤10MΩ: ±100 ppm/°C R≤10Ω || R>10 MΩ: ±200 ppm/°C Jumper Criteria Rated Current: 2A Maximum Current: 10A Yageo Datasheet <http://www.yageo.ru/pdf/RC1206.pdf> Reichelt Datasheet <http://cdn-reichelt.de/documents/datenblatt/A900/SMD_1206.pdf> Distributor Reichelt: E24 Conrad: avialable Digi-Key: -; DIST#REICHELT#: SMD 1/4W 200; VENDOR#: YAGEO#RC1206FR-07200RL
R17 = omcResistor:RC1206: YAGEO RC1206 - General Purpose Chip Resistors Power dissipation: 0.250W 1% Tolerance E96 Series Operating Temperature Range: –55°C to +155°C Maximum Working Voltage: 200V Maximum Overload Voltage: 400V Temperature Coefficient: 10Ω< R≤10MΩ: ±100 ppm/°C R≤10Ω || R>10 MΩ: ±200 ppm/°C Jumper Criteria Rated Current: 2A Maximum Current: 10A Yageo Datasheet <http://www.yageo.ru/pdf/RC1206.pdf> Reichelt Datasheet <http://cdn-reichelt.de/documents/datenblatt/A900/SMD_1206.pdf> Distributor Reichelt: E24 Conrad: avialable Digi-Key: -; DIST#REICHELT#: SMD 1/4W 0,0; VENDOR#: YAGEO#RC1206FR-070R0L
R18 = omcResistor:RC1206: YAGEO RC1206 - General Purpose Chip Resistors Power dissipation: 0.250W 1% Tolerance E96 Series Operating Temperature Range: –55°C to +155°C Maximum Working Voltage: 200V Maximum Overload Voltage: 400V Temperature Coefficient: 10Ω< R≤10MΩ: ±100 ppm/°C R≤10Ω || R>10 MΩ: ±200 ppm/°C Jumper Criteria Rated Current: 2A Maximum Current: 10A Yageo Datasheet <http://www.yageo.ru/pdf/RC1206.pdf> Reichelt Datasheet <http://cdn-reichelt.de/documents/datenblatt/A900/SMD_1206.pdf> Distributor Reichelt: E24 Conrad: avialable Digi-Key: -; DIST#REICHELT#: SMD 1/4W 47K; VENDOR#: YAGEO#RC1206FR-0747KL
R19 = omcResistor:RC1206: YAGEO RC1206 - General Purpose Chip Resistors Power dissipation: 0.250W 1% Tolerance E96 Series Operating Temperature Range: –55°C to +155°C Maximum Working Voltage: 200V Maximum Overload Voltage: 400V Temperature Coefficient: 10Ω< R≤10MΩ: ±100 ppm/°C R≤10Ω || R>10 MΩ: ±200 ppm/°C Jumper Criteria Rated Current: 2A Maximum Current: 10A Yageo Datasheet <http://www.yageo.ru/pdf/RC1206.pdf> Reichelt Datasheet <http://cdn-reichelt.de/documents/datenblatt/A900/SMD_1206.pdf> Distributor Reichelt: E24 Conrad: avialable Digi-Key: -; DIST#REICHELT#: SMD 1/4W 3,3K; VENDOR#: YAGEO#RC1206FR-073K3L
R20 = omcResistor:M44: Model 44 - Cermet Trimming Potentiometer - TT Electronics Electrical: Standard Resistance Range: 10 Ohms to 2 Megohms Standard Resistance Tolerance: ±10% (<100 Ohms = ±20%) Input Voltage: 300 Vdc Max. or rms not to exceed power rating Power Rating: 0.25 Watts at 85°C derating to 0 at 150°C Environmental: Operating Temperature: –65°C to +150°C Load Life: 1,000 hours at 85°C & 0.25 Watts Datasheet: TT Electronics <https://www.ttelectronics.com/TTElectronics/media/ProductFiles/Trimmers/Datasheets/44.pdf> Reichelt <https://cdn-reichelt.de/documents/datenblatt/B400/BI-SERIE-44.pdf>; DIST#REICHELT#: 44W-50K; VENDOR#: TT Electronics, 44 G R 50K LF
T1 T2 = omcTransistor:BSS138: BSS 138 - N-Channel Logic Level Enhancement Mode Field Effect Transistor VDSS=50V VGS=±20V RDS,on=3.5Ω Drain currunt: 200mA continous 800mA pulsed PD=225mW On Semiconductor Datasheet <http://www.onsemi.com/pub_link/Collateral/BSS138LT1-D.PDF> Reichelt Datasheet <http://cdn-reichelt.de/documents/datenblatt/A200/BSS138-FSC.pdf>; #VENDOR: ON_SEMICONDUCTOR,BSS138L; DIST#REICHELT#: BSS 138 SMD
X1 = omcConnector:SCWTRMX06: Screw solder terminal - X06 pole: 2 srew terminal, plugable rectangular cable connection, 90° stackable without lost of contact RT034 - Typ 086 - 3.81mm grid: Metz Connect Productside <http://www.metz-connect.com/de/products/310861> Metz Connect Datasheet <http://www.metz-connect.com/de/system/files/productfiles/Datenblatt_310861_RT034xxHBLC_OFF-026114I.pdf> Reichelt Datasheet <http://cdn-reichelt.de/documents/datenblatt/C151/AKL086.pdf> RT035 - Typ 094 - 5mm grid: Metz Connect Productside <http://www.metz-connect.com/de/products/310941> Metz Connect Datasheet <http://www.metz-connect.com/de/system/files/productfiles/Datenblatt_310941_RT035xxHBLU_OFF-022741Q.pdf> Metz connect terminal - electrical and mechanical parameter Parameter RT034 - Typ 086 (3.81mm grid) RT035 - Typ 094 (5mm grid) conductor diameter (single wire) 0,2 - 1,5 mm² (AWG 28 - 16) 0,2 - 1,5 mm² (AWG 26 - 16) conductor diameter (multi wire) 0,2 - 1,5 mm² (AWG 28 - 16) 0,2 - 1,5 mm² (AWG 26 - 16) smallest leackage path 2 mm 3,2 mm IEC 60529 IP 00 IP 20 strip length (min) 5mm 6 mm Distributor Reichelt: avialable Conrad: avialable Digi-Key: -; DIST#REICHELT#: AKL 086-06; VENDOR#: Metz Connect#31086106
X2 = omcConnector:BOXHD-06: Box Header 2X3 Mechanical Terminals: 6 Rows: 2 Operating Temperature: -55°C...+105°C Electrical Imax: 3A RInsulation,min: 1000MΩ Rcontact,max: 20mΩ VAC: 550V; DIST#REICHELT#: WSL 6G

## Board
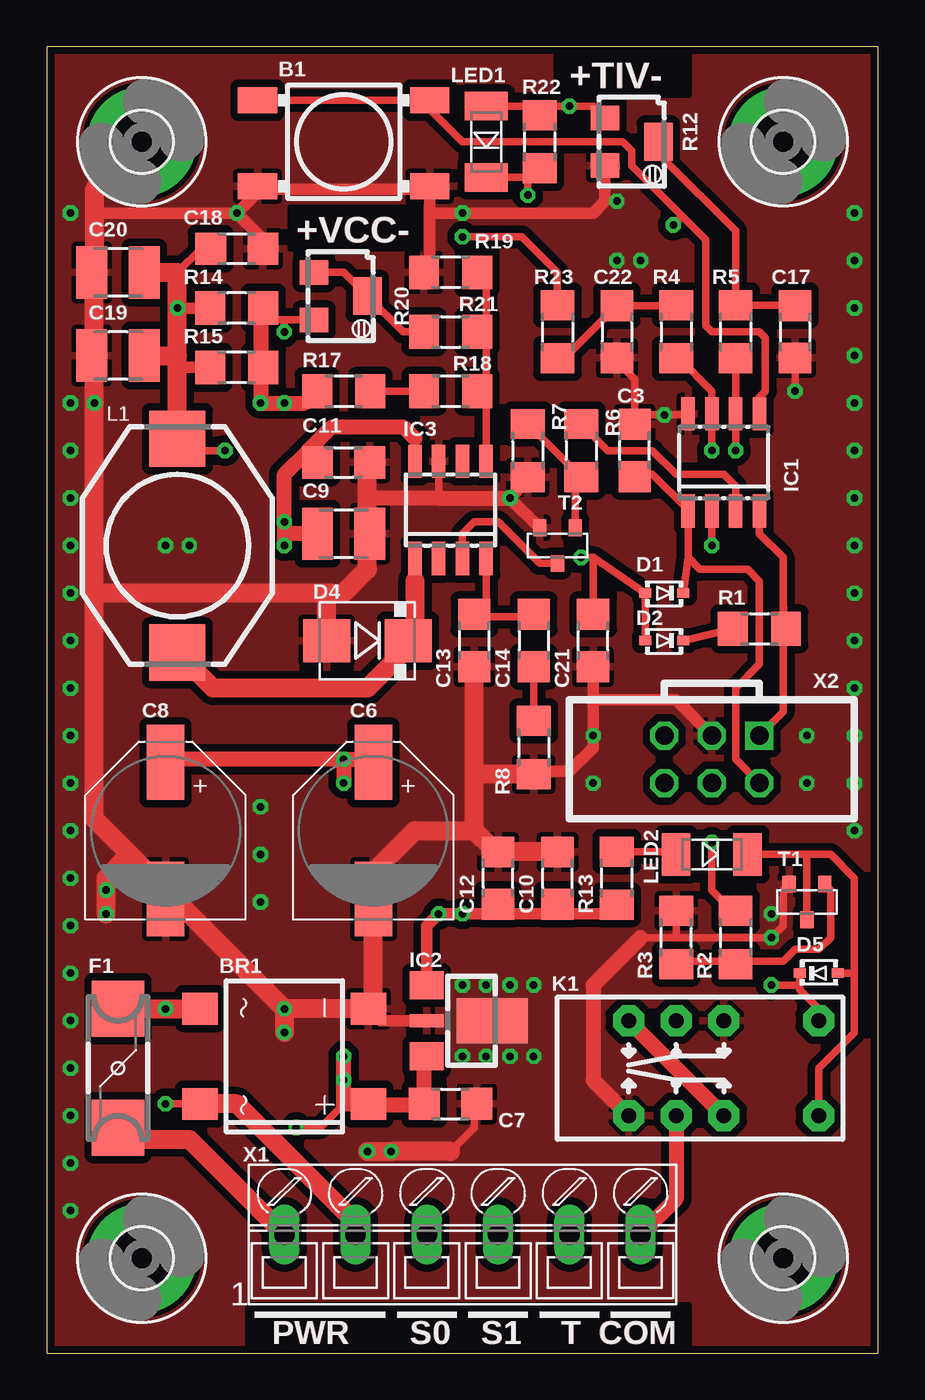
[diagram p1: board, top side]
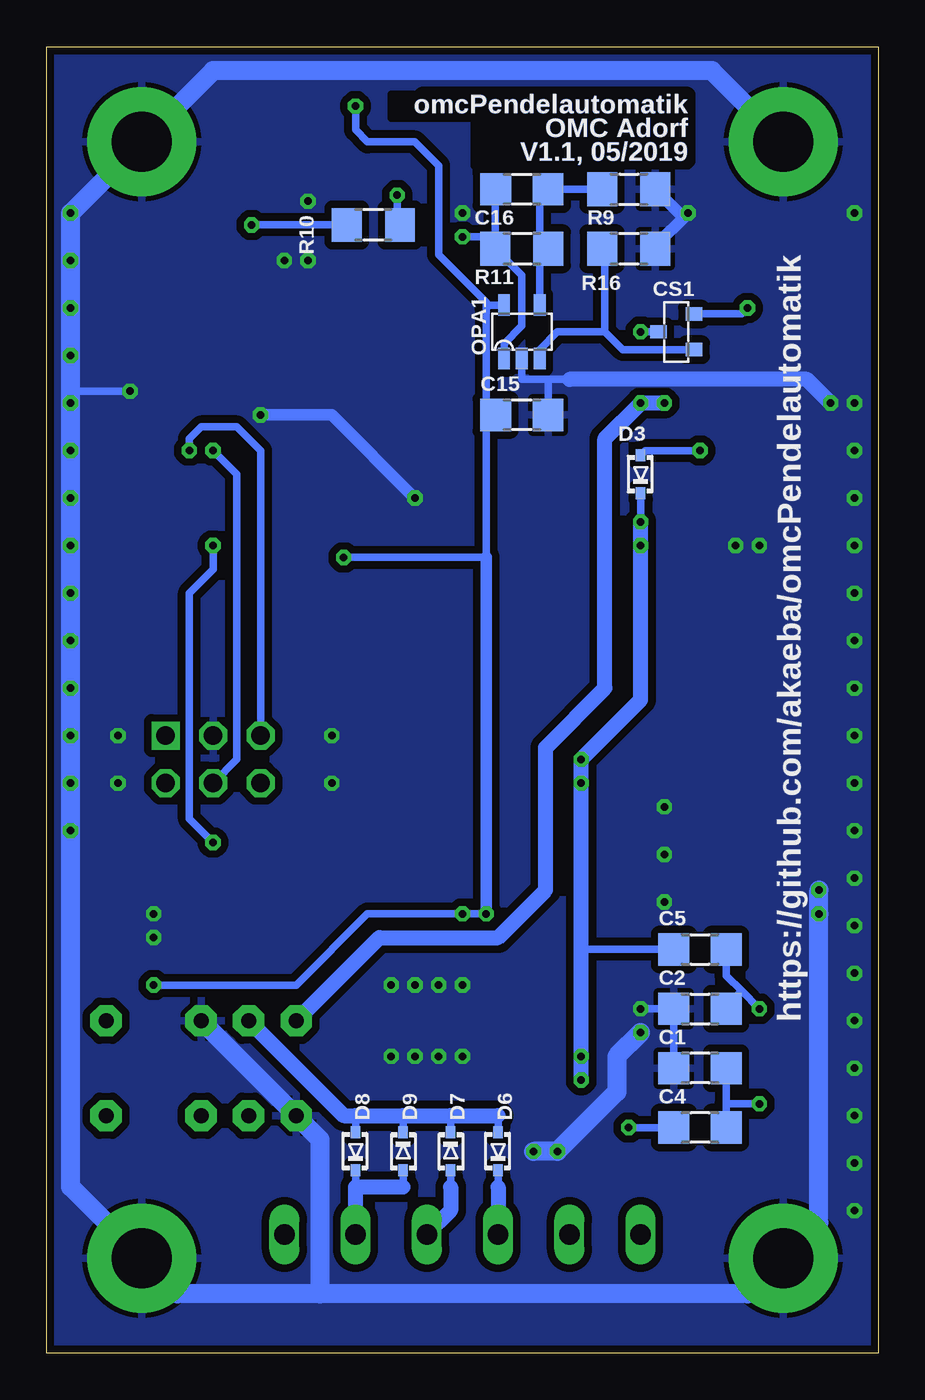
[diagram p2: board, bottom side, seen from below]

Size 44.45 x 69.85 mm. Coordinates in mm from the lower left corner, seen from the top.
Outline: 0,69.84 0,0 44.45,0 44.45,69.85 0,69.85
Copper layers (1*16): Top 0.035mm / dielectric 1.5mm / Bottom 0.035mm
Design rules "aisler_go": minimum track width 0.07mm, minimum drill 0.2mm, track to track 0.07mm, track to pad 0.07mm, pad to pad 0.07mm, via to via 0.07mm, smd to smd 0.07mm, copper to edge 0.2mm, drill to drill 0.21mm, minimum pad ring 0.25mm, minimum via ring 0.05mm, stop-mask expansion 0.05mm, vias tented up to drill 0mil, thermal gap 10mil

### Footprints (pad centres in the part's own frame; a part is rotated, then mirrored left to right if it is on the bottom)
SMD_X4_11X6 = smd 2.1 x 1.4: 1 4.604,-2.381; 2 -4.604,-2.381; 3 4.604,2.223; 4 -4.604,2.223
DBS = smd 1.7 x 1.9: + -2.55,-4.5; - 2.55,-4.5; AC1 -2.55,4.5; AC2 2.55,4.5
1206 = smd 1.651 x 1.727: 1 -1.4,0; 2 1.4,0
PANF = smd 2 x 4: CN 0,-3.651; CP 0,3.651
1210 = smd 1.651 x 2.794: 1 -1.4,0; 2 1.4,0
SOT23 = smd 0.711 x 0.889: 1 -0.953,-0.953; 2 0.953,-0.953; 3 0,0.953
SOD323 = smd 0.635 x 0.508: A 1.016,0; C -1.016,0
DO214AA = smd 2.5 x 2.3: A 2.175,0; C -2.175,0
OMT125 = smd 3 x 2.8: 1 -3.175,0; 2 3.175,0
3,2-PAD = drill 3.2 pad 5.842: B3,2 0,0
SOIC08 = smd 0.72 x 1.78: 1 -1.905,-2.6; 2 -0.635,-2.6; 3 0.635,-2.6; 4 1.905,-2.6; 5 1.905,2.6; 6 0.635,2.6; 7 -0.635,2.6; 8 -1.905,2.6
SOT89W = smd 1.5 x 1.8: 1 -1.905,-1.905; 3 1.905,-1.905 | smd 0.7 x 1.8: 2 0,-1.905 | smd 2.4 x 3.8: 4 0,1.587
SOIC08' = smd 1.78 x 0.72: 1 -2.6,1.905; 2 -2.6,0.635; 3 -2.6,-0.635; 4 -2.6,-1.905; 5 2.6,-1.905; 6 2.6,-0.635; 7 2.6,0.635; 8 2.6,1.905
THT_5M08M_5M08M_2M54M = drill 0.8 pad 1.676 octagon: 1 0,0; 3 5.08,0; 4 7.62,0; 5 10.16,0; 8 10.16,5.08; 9 7.62,5.08; 10 5.08,5.08; 12 0,5.08
PISM = smd 3 x 3: 1 -5.715,0; 2 5.715,0
LED3216 = smd 1.524 x 2.286: 1 -1.905,0; 2 1.905,0
SOT23-5 = smd 0.635 x 1.143: 1 0.953,1.111; 2 1.905,1.111; 3 2.857,1.111; 4 2.857,3.969; 5 0.953,3.969
1206' = smd 1.6 x 1.803: 1 -1.422,0; 2 1.422,0
TTM44W = smd 1.52 x 1.3: 1 4.445,1.905; 3 4.445,4.445 | smd 1.52 x 2.01: 2 1.587,3.175
RT03406T086 = drill 1.1 long: 1 0,0; 2 3.81,0; 3 7.62,0; 4 11.43,0; 5 15.24,0; 6 19.05,0
BOXHD-06-2.54-S = drill 1 square: 1 -1.27,2.54 | drill 1 octagon: 2 1.27,2.54; 3 -1.27,0; 4 1.27,0; 5 -1.27,-2.54; 6 1.27,-2.54

### Placement (x,y rotation side)
B1  15.88,64.77 0 top
BR1  12.7,15.88 90 top
C1  9.53,15.24 180 bottom
C2  9.53,18.41 0 bottom
C3  31.43,48.26 90 top
C4  9.53,12.06 180 bottom
C5  9.53,21.59 0 bottom
C6  17.46,27.94 0 top
C7  21.59,13.34 0 top
C8  6.35,27.94 0 top
C9  15.88,43.81 0 top
C10  27.3,25.4 90 top
C11  15.88,47.62 0 top
C12  24.13,25.4 90 top
C13  22.86,38.1 90 top
C14  26.04,38.1 270 top
C15  19.05,50.16 180 bottom
C16  19.05,62.23 180 bottom
C17  40.01,54.61 270 top
C18  10.16,59.05 0 top
C19  3.81,53.34 180 top
C20  3.81,57.78 180 top
C21  29.21,38.1 90 top
C22  30.48,54.61 270 top
CS1  10.79,54.61 90 bottom
D1  33.02,40.64 180 top
D2  33.02,38.1 180 top
D3  12.7,46.99 90 bottom
D4  17.14,38.1 180 top
D5  41.27,20.32 0 top
D6  20.32,10.79 90 bottom
D7  22.86,10.79 270 bottom
D8  27.94,10.79 90 bottom
D9  25.4,10.79 270 bottom
F1  3.81,15.24 90 top
H1  39.37,5.08 0 top
H2  39.37,64.77 0 top
H3  5.08,64.77 0 top
H4  5.08,5.08 0 top
IC1  36.2,47.62 0 top
IC2  22.23,17.78 270 top
IC3  L5970D  [SOIC08']  21.59,45.09 90 top
K1  41.27,17.78 180 top
L1  6.99,43.18 90 top
LED1  23.5,64.77 270 top
LED2  35.56,26.67 0 top
OPA1  20.95,52.07 0 bottom
R1  22K  [1206']  38.1,38.73 180 top
R2  10K  [1206']  36.83,22.23 90 top
R3  56K  [1206']  33.66,22.23 270 top
R4  1K  [1206']  33.66,54.61 90 top
R5  1K  [1206']  36.83,54.61 90 top
R6  10K  [1206']  28.57,48.26 90 top
R7  56K  [1206']  25.72,48.26 90 top
R8  4K7  [1206']  26.04,32.38 90 top
R9  10K  [1206']  13.34,62.23 180 bottom
R10  1K  [1206']  26.99,60.33 0 bottom
R11  39K  [1206']  19.05,59.05 180 bottom
R12  34.29,67.94 180 top
R13  1K  [1206']  30.48,25.4 270 top
R14  1R  [1206']  10.16,55.88 0 top
R15  1R  [1206']  10.16,52.7 0 top
R16  200R  [1206']  13.34,59.05 180 bottom
R17  0R  [1206']  15.88,51.44 180 top
R18  47K  [1206']  21.59,51.44 180 top
R19  3K3  [1206']  21.59,57.78 0 top
R20  18.73,59.69 180 top
R21  4K7  [1206']  21.59,54.61 180 top
R22  56K  [1206']  26.35,64.77 90 top
R23  200R  [1206']  27.3,54.61 90 top
T1  40.64,24.13 180 top
T2  27.3,43.18 180 top
X1  12.7,6.35 0 top
X2  35.56,31.75 270 top

### Tracks (layer width: path | path; a pad name or v marks a point on that pad's centre or on a via)
+5V  (via drill 0.4 pad 0.81)
  Top 0.406: 29.84,23.5 30,23.5 R13.2 30.48,23.5 | K1.1 41.27,18.41 40.26,19.43 40.26,19.68 | v38.73,19.68 40.26,19.68 | D5.C 40.26,19.68 | C12.1 24.13,23.5 | C10.1 27.3,23.5 | v28.57,42.55 29.21,42.55 | C21.2 29.21,42.55 | D2.A D1.A 29.21,42.55 | LED1.1 26.35,66.67 | R22.2 26.35,66.67 | 26.35,66.67 v27.94,66.67 29.21,66.67 R12.1
  Top 0.61: IC2.1 20.32,22.86 v20.95,23.5 v22.23,23.5 24.13,23.5 27.3,23.5 30.48,23.5
  Bottom 0.406: v38.73,19.68 31.11,19.68 27.3,23.5 v22.23,23.5 v20.95,23.5 | 20.95,55.88 20.95,56.2 23.5,58.74 23.5,63.5 24.77,64.77 27.3,64.77 27.94,65.41 v27.94,66.67 | 20.95,55.88 20.95,50.67 C15.2 20.95,49.66 20.95,42.55 v28.57,42.55 | OPA1.5 20.8,56.04 20.95,55.88
  Bottom 0.61: v20.95,23.5 20.95,42.55
GND  (via drill 0.4 pad 0.81)
  Top 0.406: 21.59,10.79 22.86,12.06 22.86,13.21 C7.2 23.02,13.34 | IC3.7 20.95,45.72 | R3.1 33.66,22.23 | 33.66,22.23 v38.73,22.23 39.37,22.86 39.37,24.77 T1.2 | 31.75,22.23 33.66,22.23 | 20.56,57.39 R19.1 | IC1.8 34.29,50.16 v33.02,50.16 31.94,50.16 C3.2 | 31.62,50.16 C3.2 | 11.43,62.23 B1.2 | C17.2 v40.01,51.44 | C22.2 30.48,53.02 31.43,52.07 C3.2
  Top 0.61: IC2.2 17.84,17.78 BR1.- | 2.54,60.96 v10.16,60.96 | R19.1 20.17,57.94 | 11.43,59.19 C18.2 11.56,59.56 v10.16,60.96 | v10.16,60.96 11.43,62.23 20.32,62.23 B1.1 20.48,60.96 | 20.48,60.96 20.48,57.47 | 20.48,60.96 v22.23,60.96 29.21,60.96 29.84,61.59 R12.3 | C21.1 29.21,34.92 | 29.21,34.92 v29.21,33.02 29.21,32.38 27.94,31.11 26.19,31.11 R8.1 | T2.2 v24.77,45.72 25.88,46.84 R7.1 | X2.3 33.66,34.92 29.21,34.92
  Top 0.813: 17.14,45.72 20.95,45.72 v24.77,45.72 | 17.94,24.13 C6.CN | K1.8 29.21,14.61 29.21,19.68 31.75,22.23 | 20.48,57.47 20.56,57.39
  Top 1.016: 6.35,24.13 C8.CN 6.51,24.29 6.67,24.45 | 14.97,38.47 D4.A 14.97,40.37 15.24,40.64 | 17.14,43.81 17.14,41.91 15.88,40.64 15.24,40.64 | 17.14,43.81 17.14,45.72 17.14,47.49 C11.2 | C9.2 17.14,43.81 | 6.67,24.45 v12.7,18.41 12.71,18.43 | 6.67,24.45 4.45,26.67 | 4.45,26.67 2.54,28.57 2.54,40.64 | 15.24,40.64 2.54,40.64 | 2.54,40.64 v2.54,50.8 2.54,53.34 | 2.54,53.34 2.54,57.66 C20.2 2.54,57.91 2.54,60.96 2.54,62.23 H3.B3,2 | C19.2 2.54,53.34 | 12.71,18.43 12.71,17.16 v12.7,17.14 | 12.71,18.43 BR1.- 17.46,19 C6.CN 17.78,26.04 19.68,27.94 22.86,27.94 | v17.14,10.79 v18.41,10.79 21.59,10.79 | 22.86,27.94 22.86,31.11 | 22.86,31.11 C13.1 | R8.1 23.01,30.96 22.86,31.11 | C10.2 C12.2 24,26.8 22.86,27.94 | v3.17,23.5 v3.17,24.77 3.17,25.4 4.45,26.67
  Bottom 0.406: C1.2 C2.1 v12.7,18.41 | 17.65,50.03 C15.1 17.65,51.94 17.78,52.07 | OPA1.2 19.05,52.07 17.78,52.07 | 17.78,52.07 16.51,52.07 | v40.01,51.44 42.86,51.44 43.18,51.75
  Bottom 0.61: R9.1 10.64,60.96 v10.16,60.96 11.91,59.21 R16.1 | v24.77,45.72 29.21,50.16 v33.02,50.16
  Bottom 0.813: v2.54,50.8 3.81,52.07 16.51,52.07
  Bottom 1.016: v12.7,17.14 13.97,15.88 13.97,13.97 v17.14,10.79 v18.41,10.79 | K1.3 K1.8 29.84,11.43 29.84,3.17 | 29.84,3.17 6.99,3.17 H4.B3,2 3.17,6.99 v3.17,23.5 v3.17,24.77 | 29.84,3.17 37.47,3.17 H1.B3,2 43.18,8.89 v43.18,27.94 v43.18,30.48 v43.18,33.02 v43.18,35.56 v43.18,38.1 v43.18,40.64 v43.18,43.18 v43.18,45.72 v43.18,48.26 v43.18,50.8 43.18,51.75 v43.18,53.34 v43.18,55.88 v43.18,58.42 v43.18,60.96 H2.B3,2 35.56,68.58 8.89,68.58 H3.B3,2
  other vias: 23.5,15.88 24.77,15.88 26.04,15.88 23.5,19.68 24.77,19.68 26.04,19.68 30.48,61.59 22.23,19.68 22.23,15.88 1.27,60.96 1.27,50.8 1.27,48.26 1.27,45.72 1.27,43.18 1.27,40.64 1.27,38.1 1.27,35.56 1.27,33.02 1.27,30.48 1.27,27.94 1.27,25.4 1.27,22.86 1.27,20.32 1.27,17.78 1.27,15.24 1.27,12.7 1.27,10.16 1.27,7.62 29.21,30.48 6.35,43.18 7.62,43.18 31.75,58.42 30.48,58.42 11.43,29.21 11.43,26.67 11.43,24.13 38.73,23.5 40.64,33.02 40.64,30.48
  pour Top (isolate 0.406, no thermals): 20.95,20.95 20.95,14.61 27.3,14.61 27.3,20.95
  pour Top (isolate 0.406): 0,69.85 0,0 44.45,0 44.45,69.85
  pour Bottom (isolate 0.406): 0,69.85 0,0 44.45,0 44.45,69.85
I_VCC
  Top 0.406: 33.66,56.52 R4.2 33.63,56.01 C22.1 27.66,53.19 R23.1
ICSPCLK  (via drill 0.4 pad 0.81)
  Top 0.406: R5.1 IC1.6 v36.83,48.26
  Bottom 0.406: X2.5 33.02,48.26 34.29,49.53 36.2,49.53 36.83,48.9 v36.83,48.26
ICSPDAT  (via drill 0.4 pad 0.81)
  Top 0.406: v35.56,48.26 IC1.7 35.56,51.44 33.81,53.19 R4.1
  Bottom 0.406: X2.4 34.29,31.75 34.29,46.99 v35.56,48.26
N$1
  Top 0.61: IC3.1 19.68,41.27 | 19.68,38.1 D4.C
  Top 1.016: 6.99,38.1 L1.1 8.89,35.56 17.14,35.56 19.68,38.1 19.68,41.27
N$2
  Top 0.406: R20.1 15.88,57.78 R20.2 19.05,54.61 R21.2
N$3
  Top 0.406: IC3.4 23.5,39.37 | 23.5,39.37 25.91,39.37 C14.1 | 23.5,39.37 22.99,39.37 C13.2
N$4
  Top 0.406: C14.2 R8.2
N$5
  Top 0.406: R2.1 36.5,20.8 | T1.1 41.91,24.77 41.91,22.23 41.27,21.59 40.01,21.59 39.37,20.95 36.98,20.95 R2.1 | R3.2 33.81,20.95 36.83,20.95 R2.1
N$6  (via drill 0.4 pad 0.81)
  Top 0.406: v13.34,12.06 14.62,12.06 15.88,13.32 | 19.68,48.9 IC3.8 | C11.1 14.47,47.76 13.97,48.26
  Top 0.813: v15.88,31.75 17.62,31.75 C6.CP | v15.88,31.75 6.51,31.75 C8.CP | v15.88,31.75 v15.88,30.48 | v15.88,15.88 v15.88,14.61 15.88,13.34 15.88,13.32 BR1.+ 17.2,13.28 20.14,13.28 C7.1 20.19,15.74 | 12.7,43.81 v12.7,44.45 12.7,46.99 13.97,48.26 15.24,49.53 19.05,49.53 19.68,48.9 | 12.7,43.81 v12.7,43.18 | C9.1 12.7,43.81
  Top 1.016: C8.CP 5.87,31.59 | 20.19,15.74 IC2.3
  Bottom 0.406: C4.2 v13.34,12.06 | C5.1 15.88,21.59 | D3.C v12.7,44.45
  Bottom 0.813: v15.88,15.88 v15.88,14.61 15.88,21.59 v15.88,30.48 v15.88,31.75 12.7,34.92 v12.7,43.18 v12.7,44.45
N$7
  Top 0.406: C3.1 31.25,46.99 32.38,46.99 34.23,45.15 34.23,45.09 IC1.1 34.29,42.55 | X2.2 36.83,31.75 36.83,35.56 38.1,36.83 38.1,41.27 37.47,41.91 34.92,41.91 34.29,42.55 | D1.C 34.29,42.55
N$8
  Top 1.016: X1.1 7.62,11.43 4.45,11.43 F1.1
N$9
  Top 0.406: IC3.5 23.5,51.44 | 23.5,51.44 23.5,54.61 | 23.5,54.61 23.5,57.3 R19.2 | R21.1 23.5,54.61 | R18.1 23.5,51.44
N$10
  Top 0.406: IC1.4 38.1,43.81 39.37,42.55 39.37,40.01 | 39.37,40.01 39.37,34.29 X2.1 | R1.1 39.37,40.01
N$11
  Top 0.406: D2.C R1.2
N$12  (via drill 0.4 pad 0.81)
  Top 0.406: R2.2 36.68,23.65 35.56,24.77 v35.56,27.3 | v35.56,43.18 IC1.2
  Bottom 0.406: v35.56,27.3 36.83,28.57 36.83,40.64 35.56,41.91 v35.56,43.18
N$13
  Top 0.406: 26.19,50.16 R7.2 28.26,47.14 28.26,46.99 | T2.1 28.26,46.99 | R6.1 28.41,46.84 28.26,46.99
N$14
  Top 0.406: IC1.3 36.83,46.35 36.2,46.99 33.66,46.99 32.38,48.26 30,48.26 R6.2
N$15
  Top 0.406: R13.1 33.5,26.82 LED2.1
N$16
  Top 0.406: R17.1 R18.2
N$17  (via drill 0.4 pad 0.81)
  Top 0.406: 8.21,13.34 v6.35,13.34
  Top 1.016: X1.2 16.51,6.99 10.16,13.34 8.21,13.34 BR1.AC1
  Bottom 0.406: C1.1 8.12,13.34 | 8.12,13.34 C4.1 8.12,12.2 | v6.35,13.34 8.12,13.34
N$18
  Bottom 0.406: D6.C 20.32,8.89
  Bottom 0.813: 20.32,8.89 X1.3
N$19
  Top 0.406: 32.38,64.45 R12.2 33.02,64.45 33.02,63.82 36.83,60.01 R5.2 39.98,56.03 C17.1
N$20
  Bottom 0.406: OPA1.4 18.1,59.05 | 18.1,59.05 18.1,61.78 C16.1 R9.2 | R11.1 18.1,59.05
N$21
  Bottom 0.406: D7.A 22.86,8.89
  Bottom 0.813: 22.86,8.89 22.86,7.62 X1.4
N$22
  Bottom 0.406: D8.A 27.94,12.7 | D9.C 25.4,12.7 | D7.C 22.86,12.7 | D6.A 20.32,12.7
  Bottom 0.813: K1.4 28.57,12.7 27.94,12.7 25.4,12.7 22.86,12.7 20.32,12.7
N$23  (via drill 0.4 pad 0.81)
  Top 1.016: F1.2 v6.35,18.41 8.19,18.41 BR1.AC2
  Bottom 0.406: C5.2 8.12,20.19 7.3,19.37 | 7.3,19.37 v6.35,18.41 | C2.2 8.12,18.55 7.3,19.37
N$24
  Top 0.813: K1.9 33.66,8.26 X1.6
N$25
  cutout Top (isolate 0.254): 13.02,61.28 13.02,59.05 20,59.05 20,61.28
N$26
  cutout Top (isolate 0.406): 10.79,2.54 10.79,0 34.29,0 34.29,2.54
N$27  (via drill 0.4 pad 0.81)
  Top 0.406: B1.4 20,66.99 | 20,66.99 22.23,64.77 30.8,64.77 31.27,64.29 31.27,63.5 33.97,60.8 | IC1.5 38.1,51.12 38.42,51.44 38.42,54.29 38.1,54.61 35.56,54.61 35.24,54.93 35.24,59.53 33.97,60.8 | v33.5,60.33 33.97,60.8 | B1.3 20,66.99
  Bottom 0.406: R10.1 v33.5,60.33
N$29
  Bottom 0.406: D9.A 25.4,8.89 | D8.C 27.94,8.89
  Bottom 0.813: X1.5 27.94,8.89 25.4,8.89
N$30
  cutout Top (isolate 0.406): 27.3,69.53 27.3,67.31 34.29,67.31 34.29,69.53
N$31
  cutout Bottom: 10.16,67.31 10.16,63.5 21.59,63.5 21.59,66.04 26.04,66.04 26.04,67.31
N$32  (via drill 0.4 pad 0.81)
  Top 0.406: LED1.2 25.72,62.87 | 25.72,62.87 25.87,62.87 R22.1 | v25.72,61.91 25.72,62.87
  Bottom 0.406: v25.72,61.91 25.72,60.48 R10.2
N$33  (via drill 0.4 pad 0.81)
  Top 0.406: v22.23,59.69 25.4,59.69 27.3,57.78 R23.2
  Bottom 0.406: OPA1.1 20,53.98 19.05,54.93 19.05,57.63 R11.2 | R11.2 20.47,62.21 C16.2 | v22.23,59.69 21.11,59.69 R11.2
REGON
  Top 0.406: IC3.3 22.23,43.81 22.86,44.45 24.13,44.45 26.35,42.23 T2.3
RLON
  Top 0.406: LED2.2 40.64,26.67 | 40.64,26.67 41.91,26.67 43.18,25.4 43.18,20.32 | 40.64,26.67 T1.3 | K1.12 41.27,15.24 43.18,17.14 43.18,20.32 | D5.A 43.18,20.32
V_ISNS
  Bottom 0.406: OPA1.3 18.1,53.66 17.14,54.61 14.61,54.61 | CS1.1 13.65,53.66 14.61,54.61 | 14.61,54.61 14.61,58.9 R16.2
VCC  (via drill 0.4 pad 0.81)
  Top 0.406: R20.3 12.7,55.24 | 11.43,55.24 12.7,55.24 | 12.7,55.24 v12.7,54.61
  Top 0.813: K1.10 K1.5 | R14.2 11.43,55.73 11.43,55.24 11.43,52.7 | 11.43,52.7 v11.43,50.8 v12.7,50.8 13.82,50.8 R17.2 | R15.2 11.43,52.7
  Bottom 0.406: CS1.3 v12.7,54.61
  Bottom 0.813: K1.5 26.67,22.23 20.32,22.23 17.78,24.77 17.78,32.38 14.61,35.56 14.61,48.9 v12.7,50.8 v11.43,50.8
VOUT  (via drill 0.4 pad 0.81)
  Top 0.406: C18.1 8.26,59.05 6.99,57.78 | v9.53,48.26 7.62,48.26
  Top 0.61: R14.1 v6.99,55.88 | R15.1 6.99,52.7 | 7.62,48.26 L1.2
  Top 1.016: L1.2 6.99,52.7 6.99,53.34 | 6.99,53.34 v6.99,55.88 6.99,57.78 C20.1 | C19.1 6.99,53.34
  Bottom 0.406: CS1.2 7.3,55.56 v6.99,55.88 | v9.53,48.26 12.45,48.26 D3.A
(copper drawn outside any net)
  shapes: Top area x5

### Text on the board
Top: +TIV- | +VCC- | PWR | S0 | S1 | T | COM
Bottom: omcPendelautomatik | OMC Adorf | V1.1, 05/2019
bPlace: https://github.com/akaeba/omcPendelautomatik
tNames: +TIV- | +VCC- | PWR | S0 | S1 | T | COM
bNames: omcPendelautomatik | OMC Adorf | V1.1, 05/2019